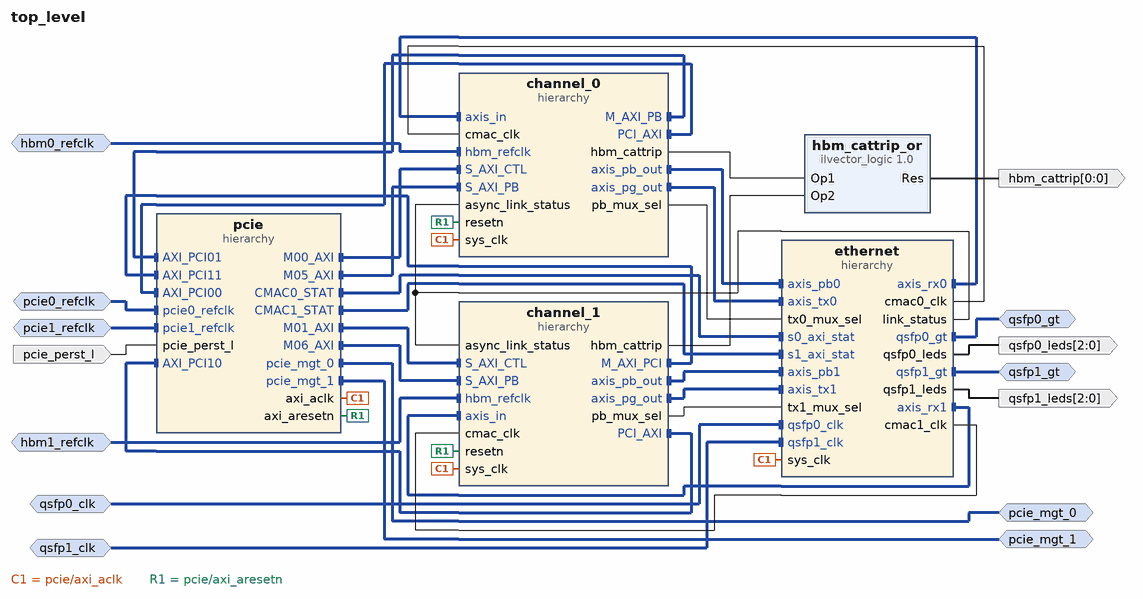
[diagram p0: block diagram of the top level]
# Vivado block design top_level, xcu55c-fsvh2892-2L-e, Vivado 2024.2
create_bd_design top_level

create_bd_intf_port -mode Slave -vlnv xilinx.com:interface:diff_clock_rtl:1.0 pcie0_refclk
create_bd_intf_port -mode Master -vlnv xilinx.com:interface:pcie_7x_mgt_rtl:1.0 pcie_mgt_0
create_bd_intf_port -mode Master -vlnv xilinx.com:interface:gt_rtl:1.0 qsfp0_gt
create_bd_intf_port -mode Slave -vlnv xilinx.com:interface:diff_clock_rtl:1.0 qsfp0_clk
set_property -dict {CONFIG.FREQ_HZ 161132812} [get_bd_intf_ports qsfp0_clk]
create_bd_intf_port -mode Slave -vlnv xilinx.com:interface:diff_clock_rtl:1.0 qsfp1_clk
set_property -dict {CONFIG.FREQ_HZ 161132812} [get_bd_intf_ports qsfp1_clk]
create_bd_intf_port -mode Master -vlnv xilinx.com:interface:gt_rtl:1.0 qsfp1_gt
create_bd_intf_port -mode Slave -vlnv xilinx.com:interface:diff_clock_rtl:1.0 hbm0_refclk
create_bd_intf_port -mode Slave -vlnv xilinx.com:interface:diff_clock_rtl:1.0 hbm1_refclk
create_bd_intf_port -mode Master -vlnv xilinx.com:interface:pcie_7x_mgt_rtl:1.0 pcie_mgt_1
create_bd_intf_port -mode Slave -vlnv xilinx.com:interface:diff_clock_rtl:1.0 pcie1_refclk
create_bd_port -dir O -from 0 -to 0 hbm_cattrip
create_bd_port -dir I -type rst pcie_perst_l
create_bd_port -dir O -from 2 -to 0 qsfp0_leds
create_bd_port -dir O -from 2 -to 0 qsfp1_leds

create_bd_cell -type hier pcie
create_bd_cell -type hier ethernet
create_bd_cell -type hier channel_0
create_bd_cell -type hier channel_1
create_bd_cell -type inline_hdl -vlnv xilinx.com:inline_hdl:ilvector_logic:1.0 hbm_cattrip_or
set_property -dict {CONFIG.C_OPERATION or CONFIG.C_SIZE 1} [get_bd_cells hbm_cattrip_or]

# ---- hierarchy /pcie ----
current_bd_instance /pcie
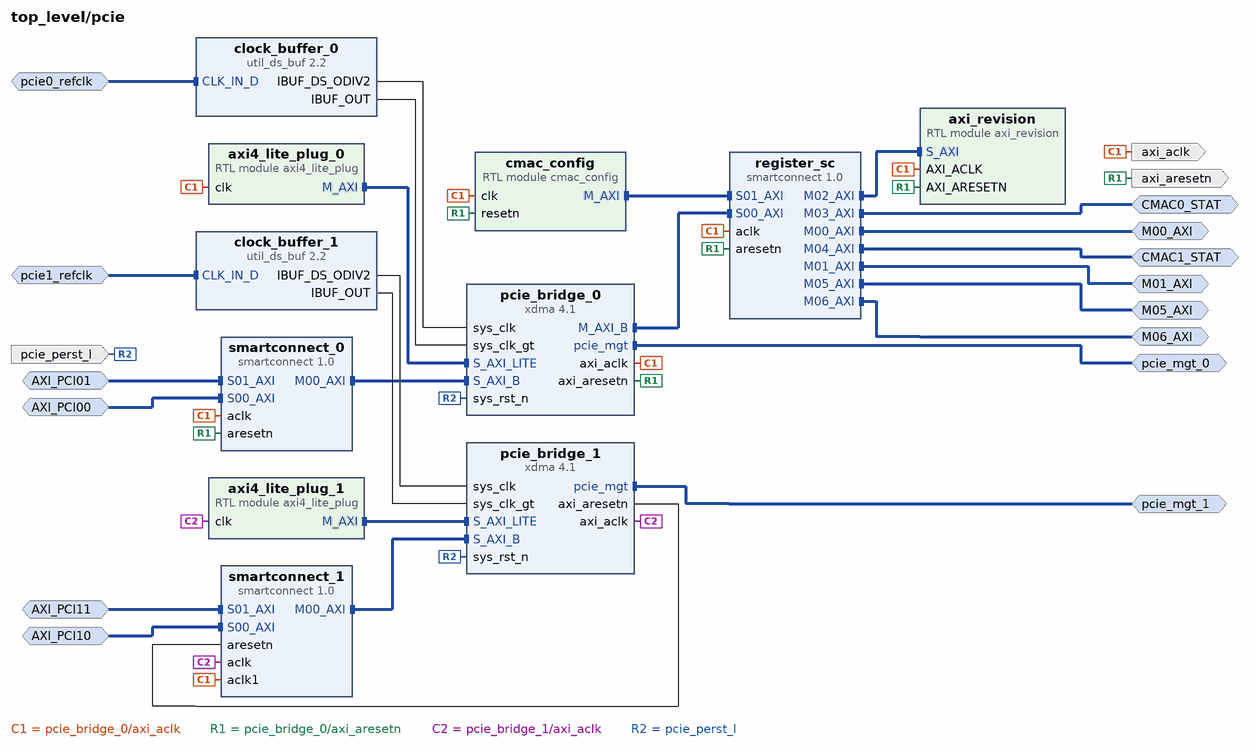
[diagram p1: block diagram inside /pcie]
create_bd_intf_pin -mode Master -vlnv xilinx.com:interface:pcie_7x_mgt_rtl:1.0 pcie_mgt_0
create_bd_intf_pin -mode Slave -vlnv xilinx.com:interface:diff_clock_rtl:1.0 pcie0_refclk
create_bd_intf_pin -mode Master -vlnv xilinx.com:interface:aximm_rtl:1.0 M00_AXI
create_bd_intf_pin -mode Master -vlnv xilinx.com:interface:aximm_rtl:1.0 M01_AXI
create_bd_intf_pin -mode Slave -vlnv xilinx.com:interface:aximm_rtl:1.0 AXI_PCI00
create_bd_intf_pin -mode Master -vlnv xilinx.com:interface:aximm_rtl:1.0 CMAC0_STAT
create_bd_intf_pin -mode Master -vlnv xilinx.com:interface:aximm_rtl:1.0 CMAC1_STAT
create_bd_intf_pin -mode Slave -vlnv xilinx.com:interface:diff_clock_rtl:1.0 pcie1_refclk
create_bd_intf_pin -mode Slave -vlnv xilinx.com:interface:aximm_rtl:1.0 AXI_PCI10
create_bd_intf_pin -mode Master -vlnv xilinx.com:interface:pcie_7x_mgt_rtl:1.0 pcie_mgt_1
create_bd_intf_pin -mode Master -vlnv xilinx.com:interface:aximm_rtl:1.0 M05_AXI
create_bd_intf_pin -mode Master -vlnv xilinx.com:interface:aximm_rtl:1.0 M06_AXI
create_bd_intf_pin -mode Slave -vlnv xilinx.com:interface:aximm_rtl:1.0 AXI_PCI01
create_bd_intf_pin -mode Slave -vlnv xilinx.com:interface:aximm_rtl:1.0 AXI_PCI11
create_bd_pin -dir I -type rst pcie_perst_l
create_bd_pin -dir O axi_aresetn
create_bd_pin -dir O axi_aclk

create_bd_cell -type ip -vlnv xilinx.com:ip:xdma:4.1 pcie_bridge_0
set_property -dict [list \
  CONFIG.PF0_DEVICE_ID_mqdma 9048 \
  CONFIG.PF0_SRIOV_VF_DEVICE_ID A048 \
  CONFIG.PF2_DEVICE_ID_mqdma 9248 \
  CONFIG.PF3_DEVICE_ID_mqdma 9348 \
  CONFIG.axi_addr_width 64 \
  CONFIG.axi_data_width 512_bit \
  CONFIG.axisten_freq 250 \
  CONFIG.bridge_burst true \
  CONFIG.en_axi_slave_if true \
  CONFIG.en_gt_selection false \
  CONFIG.functional_mode AXI_Bridge \
  CONFIG.mode_selection Advanced \
  CONFIG.pcie_blk_locn PCIE4C_X1Y1 \
  CONFIG.pf0_bar0_scale Megabytes \
  CONFIG.pf0_bar0_size 1 \
  CONFIG.pf0_device_id 903F \
  CONFIG.pf0_msi_enabled false \
  CONFIG.pl_link_cap_max_link_speed 16.0_GT/s \
  CONFIG.pl_link_cap_max_link_width X8 \
  CONFIG.runbit_fix false \
  CONFIG.xlnx_ref_board None \
] [get_bd_cells pcie_bridge_0]
create_bd_cell -type ip -vlnv xilinx.com:ip:util_ds_buf:2.2 clock_buffer_0
set_property -dict {CONFIG.C_BUF_TYPE IBUFDSGTE} [get_bd_cells clock_buffer_0]
create_bd_cell -type module -reference axi4_lite_plug axi4_lite_plug_0
create_bd_cell -type ip -vlnv xilinx.com:ip:smartconnect:1.0 register_sc
set_property -dict {CONFIG.NUM_MI 7 CONFIG.NUM_SI 2} [get_bd_cells register_sc]
create_bd_cell -type module -reference axi_revision axi_revision
create_bd_cell -type ip -vlnv xilinx.com:ip:smartconnect:1.0 smartconnect_0
create_bd_cell -type ip -vlnv xilinx.com:ip:xdma:4.1 pcie_bridge_1
set_property -dict [list \
  CONFIG.PF0_DEVICE_ID_mqdma 9048 \
  CONFIG.PF0_SRIOV_VF_DEVICE_ID A048 \
  CONFIG.PF2_DEVICE_ID_mqdma 9248 \
  CONFIG.PF3_DEVICE_ID_mqdma 9348 \
  CONFIG.axi_addr_width 64 \
  CONFIG.axi_data_width 512_bit \
  CONFIG.axisten_freq 250 \
  CONFIG.bridge_burst true \
  CONFIG.en_axi_master_if false \
  CONFIG.en_axi_slave_if true \
  CONFIG.en_gt_selection true \
  CONFIG.functional_mode AXI_Bridge \
  CONFIG.mode_selection Advanced \
  CONFIG.pcie_blk_locn PCIE4C_X1Y0 \
  CONFIG.pf0_bar0_scale Megabytes \
  CONFIG.pf0_bar0_size 1 \
  CONFIG.pf0_device_id 9040 \
  CONFIG.pf0_msi_enabled false \
  CONFIG.pl_link_cap_max_link_speed 16.0_GT/s \
  CONFIG.pl_link_cap_max_link_width X8 \
  CONFIG.runbit_fix false \
  CONFIG.select_quad GTY_Quad_225 \
  CONFIG.xlnx_ref_board None \
] [get_bd_cells pcie_bridge_1]
create_bd_cell -type ip -vlnv xilinx.com:ip:util_ds_buf:2.2 clock_buffer_1
set_property -dict {CONFIG.C_BUF_TYPE IBUFDSGTE} [get_bd_cells clock_buffer_1]
create_bd_cell -type module -reference axi4_lite_plug axi4_lite_plug_1
create_bd_cell -type ip -vlnv xilinx.com:ip:smartconnect:1.0 smartconnect_1
set_property -dict {CONFIG.NUM_CLKS 2} [get_bd_cells smartconnect_1]
create_bd_cell -type module -reference cmac_config cmac_config

# ---- hierarchy /ethernet ----
current_bd_instance /ethernet
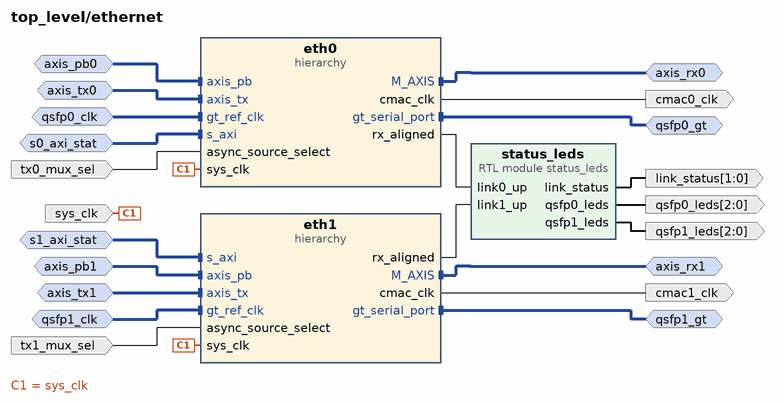
[diagram p2: block diagram inside /ethernet]
create_bd_intf_pin -mode Master -vlnv xilinx.com:interface:gt_rtl:1.0 qsfp0_gt
create_bd_intf_pin -mode Slave -vlnv xilinx.com:interface:diff_clock_rtl:1.0 qsfp0_clk
create_bd_intf_pin -mode Slave -vlnv xilinx.com:interface:axis_rtl:1.0 axis_tx0
create_bd_intf_pin -mode Master -vlnv xilinx.com:interface:axis_rtl:1.0 axis_rx0
create_bd_intf_pin -mode Master -vlnv xilinx.com:interface:gt_rtl:1.0 qsfp1_gt
create_bd_intf_pin -mode Slave -vlnv xilinx.com:interface:diff_clock_rtl:1.0 qsfp1_clk
create_bd_intf_pin -mode Master -vlnv xilinx.com:interface:axis_rtl:1.0 axis_rx1
create_bd_intf_pin -mode Slave -vlnv xilinx.com:interface:axis_rtl:1.0 axis_tx1
create_bd_intf_pin -mode Slave -vlnv xilinx.com:interface:aximm_rtl:1.0 s0_axi_stat
create_bd_intf_pin -mode Slave -vlnv xilinx.com:interface:aximm_rtl:1.0 s1_axi_stat
create_bd_intf_pin -mode Slave -vlnv xilinx.com:interface:axis_rtl:1.0 axis_pb0
create_bd_intf_pin -mode Slave -vlnv xilinx.com:interface:axis_rtl:1.0 axis_pb1
create_bd_pin -dir I sys_clk
create_bd_pin -dir O -from 2 -to 0 qsfp0_leds
create_bd_pin -dir O -from 2 -to 0 qsfp1_leds
create_bd_pin -dir O cmac0_clk
create_bd_pin -dir O cmac1_clk
create_bd_pin -dir O -from 1 -to 0 link_status
create_bd_pin -dir I tx0_mux_sel
create_bd_pin -dir I tx1_mux_sel

create_bd_cell -type hier eth0
create_bd_cell -type hier eth1
create_bd_cell -type module -reference status_leds status_leds

# ---- hierarchy /ethernet/eth0 ----
current_bd_instance /ethernet/eth0
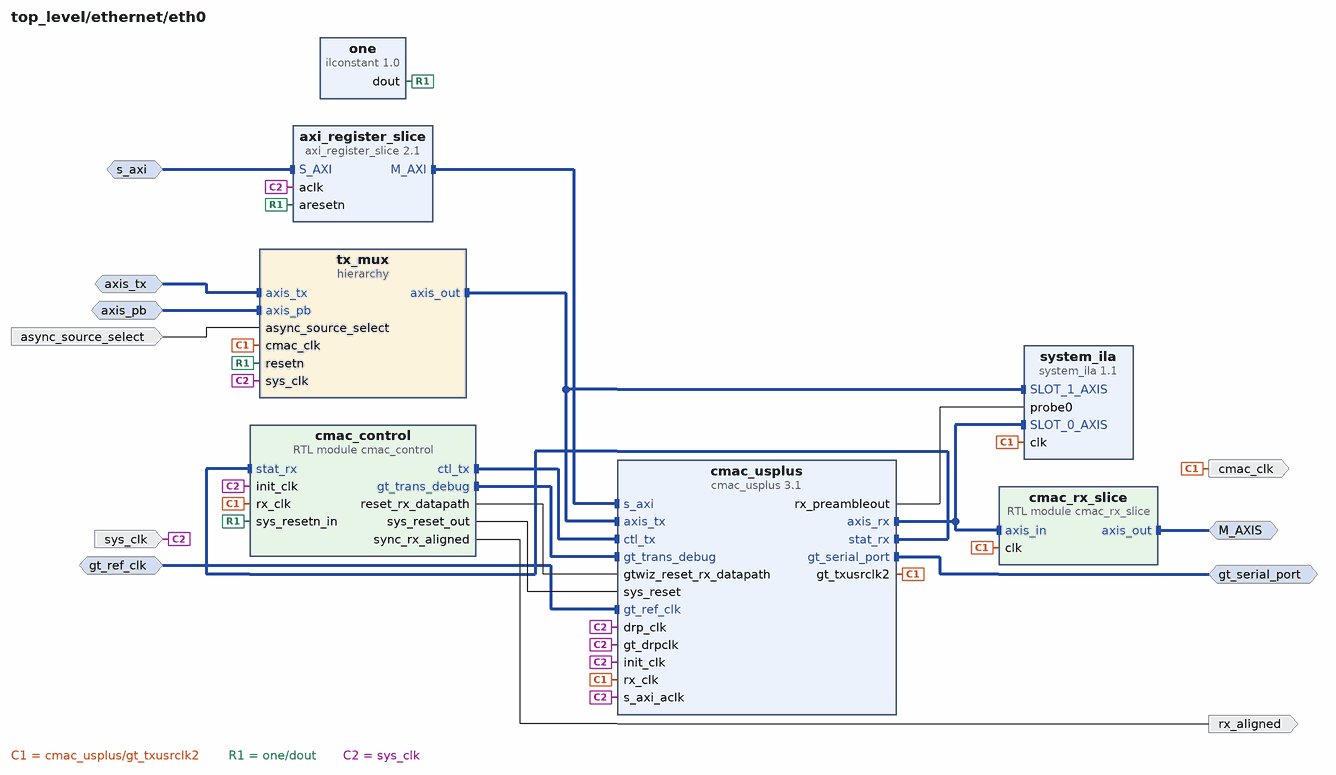
[diagram p3: block diagram inside /ethernet/eth0]
create_bd_intf_pin -mode Master -vlnv xilinx.com:interface:gt_rtl:1.0 gt_serial_port
create_bd_intf_pin -mode Slave -vlnv xilinx.com:interface:diff_clock_rtl:1.0 gt_ref_clk
create_bd_intf_pin -mode Master -vlnv xilinx.com:interface:axis_rtl:1.0 M_AXIS
create_bd_intf_pin -mode Slave -vlnv xilinx.com:interface:aximm_rtl:1.0 s_axi
create_bd_intf_pin -mode Slave -vlnv xilinx.com:interface:axis_rtl:1.0 axis_tx
create_bd_intf_pin -mode Slave -vlnv xilinx.com:interface:axis_rtl:1.0 axis_pb
create_bd_pin -dir I sys_clk
create_bd_pin -dir O rx_aligned
create_bd_pin -dir O cmac_clk
create_bd_pin -dir I async_source_select

create_bd_cell -type module -reference cmac_control cmac_control
set_property -dict {CONFIG.USE_SYS_RESET_OUT 0} [get_bd_cells cmac_control]
create_bd_cell -type ip -vlnv xilinx.com:ip:cmac_usplus:3.1 cmac_usplus
set_property -dict [list \
  CONFIG.ADD_GT_CNRL_STS_PORTS 1 \
  CONFIG.CMAC_CAUI4_MODE 1 \
  CONFIG.ENABLE_AXI_INTERFACE 1 \
  CONFIG.GT_DRP_CLK 250 \
  CONFIG.INCLUDE_RS_FEC 1 \
  CONFIG.INCLUDE_STATISTICS_COUNTERS 1 \
  CONFIG.RX_FLOW_CONTROL 0 \
  CONFIG.TX_FLOW_CONTROL 0 \
  CONFIG.USER_INTERFACE AXIS \
] [get_bd_cells cmac_usplus]
create_bd_cell -type ip -vlnv xilinx.com:ip:system_ila:1.1 system_ila
set_property -dict [list \
  CONFIG.C_DATA_DEPTH 2048 \
  CONFIG.C_MON_TYPE MIX \
  CONFIG.C_NUM_MONITOR_SLOTS 2 \
  CONFIG.C_SLOT 0 \
  CONFIG.C_SLOT_0_INTF_TYPE xilinx.com:interface:axis_rtl:1.0 \
  CONFIG.C_SLOT_1_INTF_TYPE xilinx.com:interface:axis_rtl:1.0 \
] [get_bd_cells system_ila]
create_bd_cell -type inline_hdl -vlnv xilinx.com:inline_hdl:ilconstant:1.0 one
create_bd_cell -type module -reference cmac_rx_slice cmac_rx_slice
create_bd_cell -type hier tx_mux
create_bd_cell -type ip -vlnv xilinx.com:ip:axi_register_slice:2.1 axi_register_slice

# ---- hierarchy /ethernet/eth0/tx_mux ----
current_bd_instance /ethernet/eth0/tx_mux
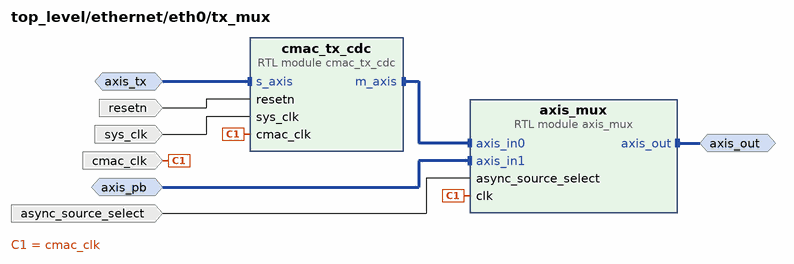
[diagram p4: block diagram inside /ethernet/eth0/tx_mux]
create_bd_intf_pin -mode Slave -vlnv xilinx.com:interface:axis_rtl:1.0 axis_tx
create_bd_intf_pin -mode Slave -vlnv xilinx.com:interface:axis_rtl:1.0 axis_pb
create_bd_intf_pin -mode Master -vlnv xilinx.com:interface:axis_rtl:1.0 axis_out
create_bd_pin -dir I sys_clk
create_bd_pin -dir I -type rst resetn
create_bd_pin -dir I -type clk cmac_clk
create_bd_pin -dir I async_source_select

create_bd_cell -type module -reference cmac_tx_cdc cmac_tx_cdc
set_property -dict {CONFIG.HAS_TKEEP 1} [get_bd_cells cmac_tx_cdc]
create_bd_cell -type module -reference axis_mux axis_mux

# ---- hierarchy /ethernet/eth1 ----
current_bd_instance /ethernet/eth1
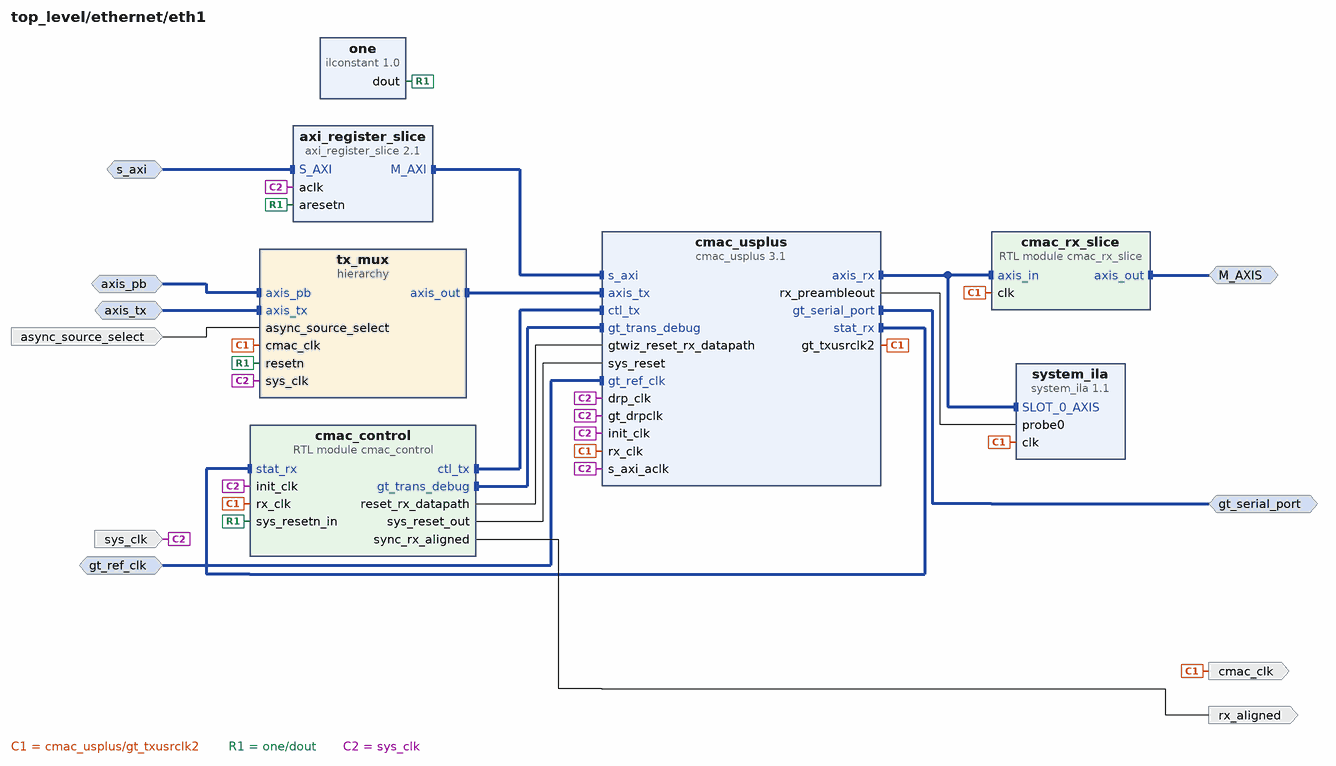
[diagram p5: block diagram inside /ethernet/eth1]
create_bd_intf_pin -mode Master -vlnv xilinx.com:interface:gt_rtl:1.0 gt_serial_port
create_bd_intf_pin -mode Slave -vlnv xilinx.com:interface:diff_clock_rtl:1.0 gt_ref_clk
create_bd_intf_pin -mode Master -vlnv xilinx.com:interface:axis_rtl:1.0 M_AXIS
create_bd_intf_pin -mode Slave -vlnv xilinx.com:interface:aximm_rtl:1.0 s_axi
create_bd_intf_pin -mode Slave -vlnv xilinx.com:interface:axis_rtl:1.0 axis_tx
create_bd_intf_pin -mode Slave -vlnv xilinx.com:interface:axis_rtl:1.0 axis_pb
create_bd_pin -dir I sys_clk
create_bd_pin -dir O rx_aligned
create_bd_pin -dir O cmac_clk
create_bd_pin -dir I async_source_select

create_bd_cell -type module -reference cmac_control cmac_control
set_property -dict {CONFIG.USE_SYS_RESET_OUT 0} [get_bd_cells cmac_control]
create_bd_cell -type ip -vlnv xilinx.com:ip:cmac_usplus:3.1 cmac_usplus
set_property -dict [list \
  CONFIG.ADD_GT_CNRL_STS_PORTS 1 \
  CONFIG.CMAC_CAUI4_MODE 1 \
  CONFIG.CMAC_CORE_SELECT CMACE4_X0Y4 \
  CONFIG.ENABLE_AXI_INTERFACE 1 \
  CONFIG.GT_DRP_CLK 250 \
  CONFIG.GT_GROUP_SELECT {X0Y28~X0Y31} \
  CONFIG.INCLUDE_RS_FEC 1 \
  CONFIG.INCLUDE_STATISTICS_COUNTERS 1 \
  CONFIG.RX_FLOW_CONTROL 0 \
  CONFIG.TX_FLOW_CONTROL 0 \
  CONFIG.USER_INTERFACE AXIS \
] [get_bd_cells cmac_usplus]
create_bd_cell -type ip -vlnv xilinx.com:ip:system_ila:1.1 system_ila
set_property -dict [list \
  CONFIG.C_DATA_DEPTH 2048 \
  CONFIG.C_MON_TYPE MIX \
  CONFIG.C_NUM_MONITOR_SLOTS 2 \
  CONFIG.C_SLOT 1 \
  CONFIG.C_SLOT_0_INTF_TYPE xilinx.com:interface:axis_rtl:1.0 \
  CONFIG.C_SLOT_1_INTF_TYPE xilinx.com:interface:axis_rtl:1.0 \
] [get_bd_cells system_ila]
create_bd_cell -type inline_hdl -vlnv xilinx.com:inline_hdl:ilconstant:1.0 one
create_bd_cell -type module -reference cmac_rx_slice cmac_rx_slice
create_bd_cell -type ip -vlnv xilinx.com:ip:axi_register_slice:2.1 axi_register_slice
create_bd_cell -type hier tx_mux

# ---- hierarchy /ethernet/eth1/tx_mux ----
current_bd_instance /ethernet/eth1/tx_mux
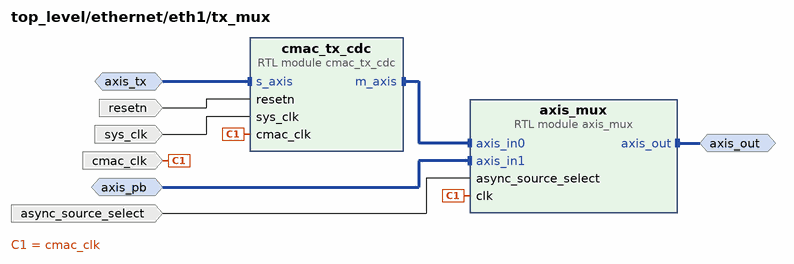
[diagram p6: block diagram inside /ethernet/eth1/tx_mux]
create_bd_intf_pin -mode Slave -vlnv xilinx.com:interface:axis_rtl:1.0 axis_tx
create_bd_intf_pin -mode Slave -vlnv xilinx.com:interface:axis_rtl:1.0 axis_pb
create_bd_intf_pin -mode Master -vlnv xilinx.com:interface:axis_rtl:1.0 axis_out
create_bd_pin -dir I sys_clk
create_bd_pin -dir I -type rst resetn
create_bd_pin -dir I -type clk cmac_clk
create_bd_pin -dir I async_source_select

create_bd_cell -type module -reference cmac_tx_cdc cmac_tx_cdc
set_property -dict {CONFIG.HAS_TKEEP 1} [get_bd_cells cmac_tx_cdc]
create_bd_cell -type module -reference axis_mux axis_mux

# ---- hierarchy /channel_0 ----
current_bd_instance /channel_0
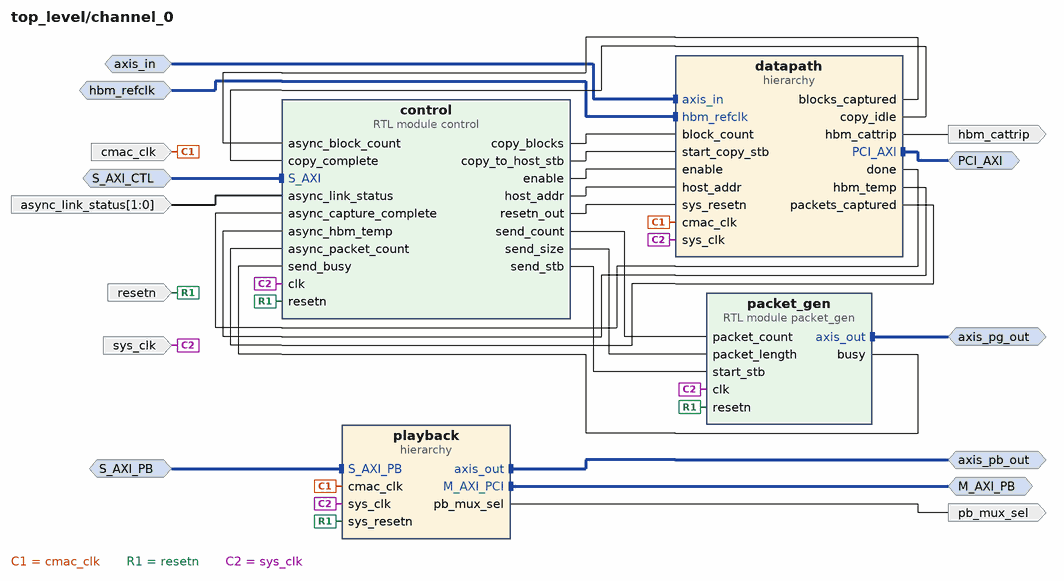
[diagram p7: block diagram inside /channel_0]
create_bd_intf_pin -mode Slave -vlnv xilinx.com:interface:aximm_rtl:1.0 S_AXI_CTL
create_bd_intf_pin -mode Master -vlnv xilinx.com:interface:axis_rtl:1.0 axis_pg_out
create_bd_intf_pin -mode Slave -vlnv xilinx.com:interface:axis_rtl:1.0 axis_in
create_bd_intf_pin -mode Slave -vlnv xilinx.com:interface:diff_clock_rtl:1.0 hbm_refclk
create_bd_intf_pin -mode Master -vlnv xilinx.com:interface:aximm_rtl:1.0 PCI_AXI
create_bd_intf_pin -mode Master -vlnv xilinx.com:interface:aximm_rtl:1.0 M_AXI_PB
create_bd_intf_pin -mode Master -vlnv xilinx.com:interface:axis_rtl:1.0 axis_pb_out
create_bd_intf_pin -mode Slave -vlnv xilinx.com:interface:aximm_rtl:1.0 S_AXI_PB
create_bd_pin -dir I -type rst resetn
create_bd_pin -dir I cmac_clk
create_bd_pin -dir I sys_clk
create_bd_pin -dir O hbm_cattrip
create_bd_pin -dir I -from 1 -to 0 async_link_status
create_bd_pin -dir O pb_mux_sel

create_bd_cell -type module -reference control control
create_bd_cell -type module -reference packet_gen packet_gen
create_bd_cell -type hier datapath
create_bd_cell -type hier playback

# ---- hierarchy /channel_0/datapath ----
current_bd_instance /channel_0/datapath
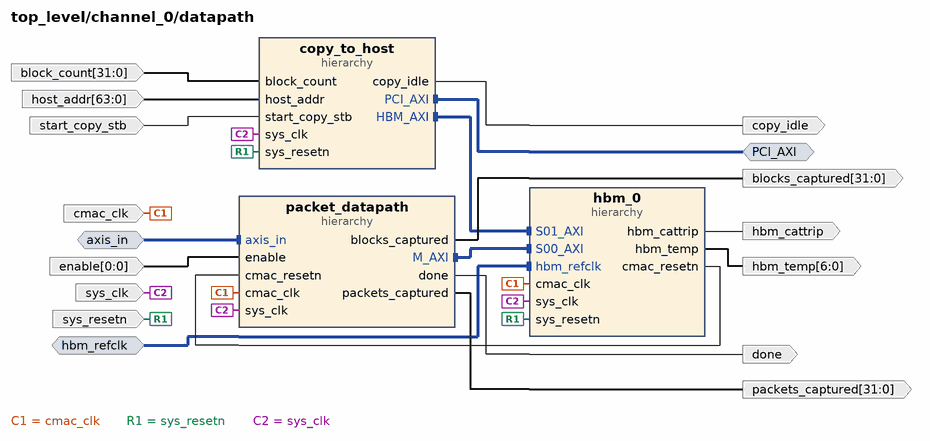
[diagram p8: block diagram inside /channel_0/datapath]
create_bd_intf_pin -mode Master -vlnv xilinx.com:interface:aximm_rtl:1.0 PCI_AXI
create_bd_intf_pin -mode Slave -vlnv xilinx.com:interface:diff_clock_rtl:1.0 hbm_refclk
create_bd_intf_pin -mode Slave -vlnv xilinx.com:interface:axis_rtl:1.0 axis_in
create_bd_pin -dir I -from 63 -to 0 host_addr
create_bd_pin -dir I -from 31 -to 0 block_count
create_bd_pin -dir I start_copy_stb
create_bd_pin -dir O copy_idle
create_bd_pin -dir I sys_clk
create_bd_pin -dir O hbm_cattrip
create_bd_pin -dir O -from 6 -to 0 hbm_temp
create_bd_pin -dir O done
create_bd_pin -dir O -from 31 -to 0 blocks_captured
create_bd_pin -dir O -from 31 -to 0 packets_captured
create_bd_pin -dir I sys_resetn
create_bd_pin -dir I -from 0 -to 0 enable
create_bd_pin -dir I cmac_clk

create_bd_cell -type hier hbm_0
create_bd_cell -type hier copy_to_host
create_bd_cell -type hier packet_datapath

# ---- hierarchy /channel_0/datapath/hbm_0 ----
current_bd_instance /channel_0/datapath/hbm_0
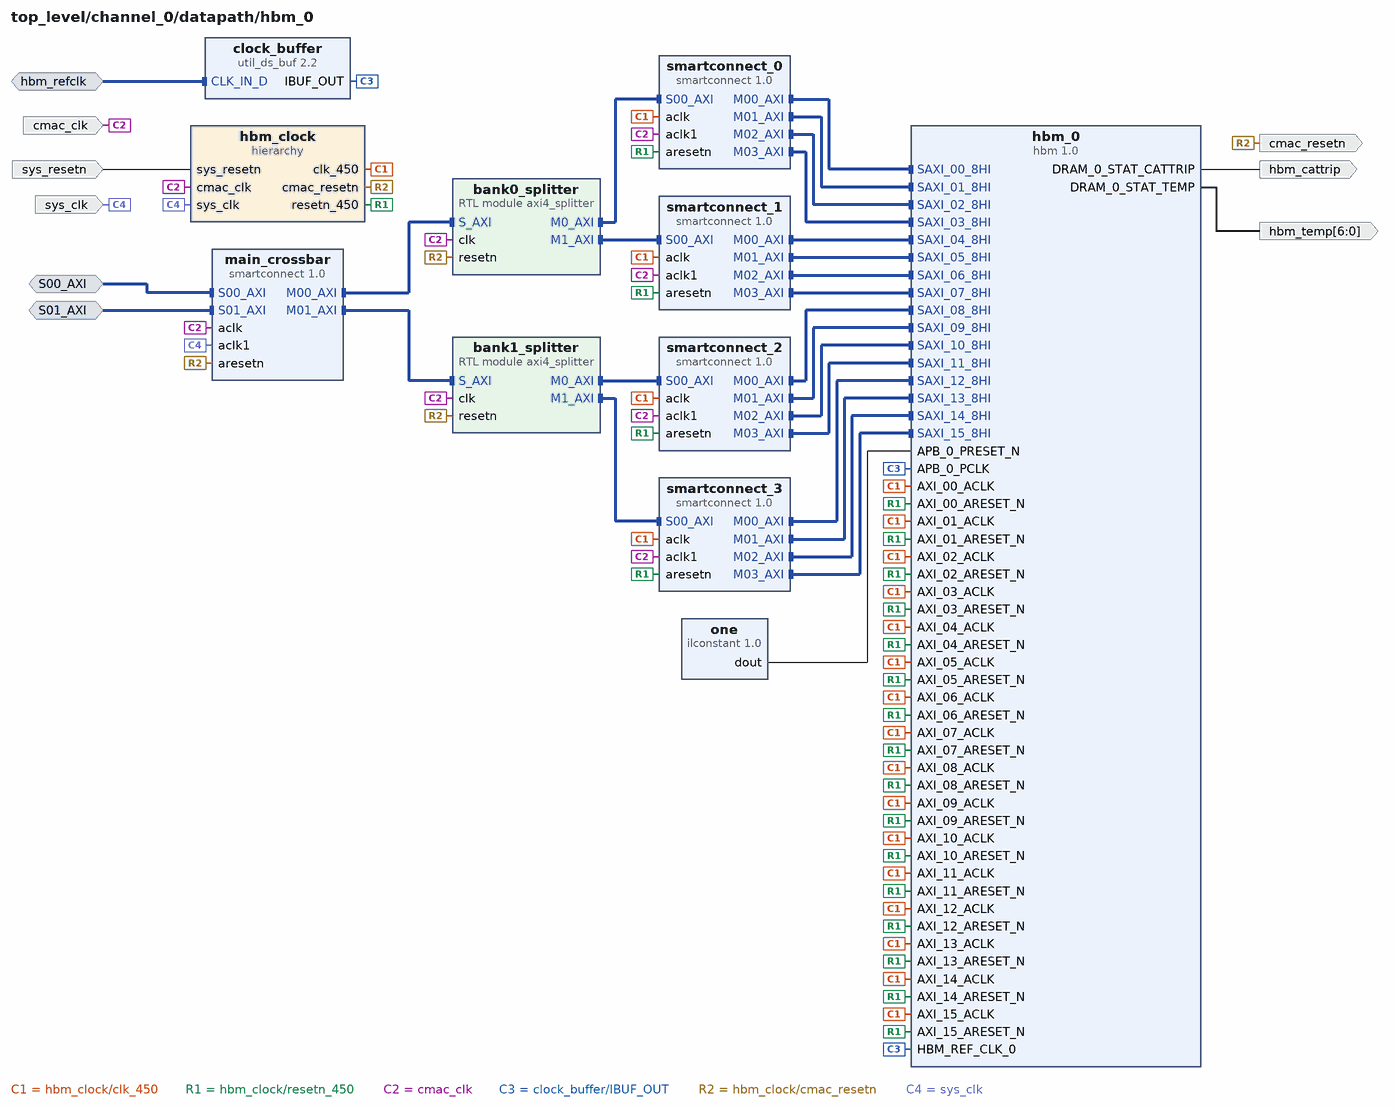
[diagram p9: block diagram inside /channel_0/datapath/hbm_0]
create_bd_intf_pin -mode Slave -vlnv xilinx.com:interface:diff_clock_rtl:1.0 hbm_refclk
create_bd_intf_pin -mode Slave -vlnv xilinx.com:interface:aximm_rtl:1.0 S00_AXI
create_bd_intf_pin -mode Slave -vlnv xilinx.com:interface:aximm_rtl:1.0 S01_AXI
create_bd_pin -dir O -from 6 -to 0 hbm_temp
create_bd_pin -dir O hbm_cattrip
create_bd_pin -dir I cmac_clk
create_bd_pin -dir I sys_clk
create_bd_pin -dir I sys_resetn
create_bd_pin -dir O cmac_resetn

create_bd_cell -type ip -vlnv xilinx.com:ip:hbm:1.0 hbm_0
set_property -dict [list \
  CONFIG.USER_APB_EN false \
  CONFIG.USER_MC0_ENABLE_ECC_CORRECTION true \
  CONFIG.USER_MC0_TRAFFIC_OPTION Linear \
  CONFIG.USER_SWITCH_ENABLE_00 FALSE \
] [get_bd_cells hbm_0]
create_bd_cell -type inline_hdl -vlnv xilinx.com:inline_hdl:ilconstant:1.0 one
create_bd_cell -type ip -vlnv xilinx.com:ip:util_ds_buf:2.2 clock_buffer
create_bd_cell -type module -reference axi4_splitter bank0_splitter
set_property -dict {CONFIG.BASE_ADDR1 0x0000000080000000} [get_bd_cells bank0_splitter]
create_bd_cell -type module -reference axi4_splitter bank1_splitter
set_property -dict [list \
  CONFIG.ADDR_OFFSET 0x0000000100000000 \
  CONFIG.BASE_ADDR0 0x0000000100000000 \
  CONFIG.BASE_ADDR1 0x0000000180000000 \
] [get_bd_cells bank1_splitter]
create_bd_cell -type ip -vlnv xilinx.com:ip:smartconnect:1.0 smartconnect_0
set_property -dict [list \
  CONFIG.ADVANCED_PROPERTIES {     __view__ { functional { M00_Buffer { AW_SIZE 4 } } }    } \
  CONFIG.NUM_CLKS 2 \
  CONFIG.NUM_MI 4 \
  CONFIG.NUM_SI 1 \
] [get_bd_cells smartconnect_0]
create_bd_cell -type ip -vlnv xilinx.com:ip:smartconnect:1.0 smartconnect_1
set_property -dict {CONFIG.NUM_CLKS 2 CONFIG.NUM_MI 4 CONFIG.NUM_SI 1} [get_bd_cells smartconnect_1]
create_bd_cell -type ip -vlnv xilinx.com:ip:smartconnect:1.0 smartconnect_2
set_property -dict {CONFIG.NUM_CLKS 2 CONFIG.NUM_MI 4 CONFIG.NUM_SI 1} [get_bd_cells smartconnect_2]
create_bd_cell -type ip -vlnv xilinx.com:ip:smartconnect:1.0 smartconnect_3
set_property -dict {CONFIG.NUM_CLKS 2 CONFIG.NUM_MI 4 CONFIG.NUM_SI 1} [get_bd_cells smartconnect_3]
create_bd_cell -type ip -vlnv xilinx.com:ip:smartconnect:1.0 main_crossbar
set_property -dict {CONFIG.NUM_CLKS 2 CONFIG.NUM_MI 2} [get_bd_cells main_crossbar]
create_bd_cell -type hier hbm_clock

# ---- hierarchy /channel_0/datapath/hbm_0/hbm_clock ----
current_bd_instance /channel_0/datapath/hbm_0/hbm_clock
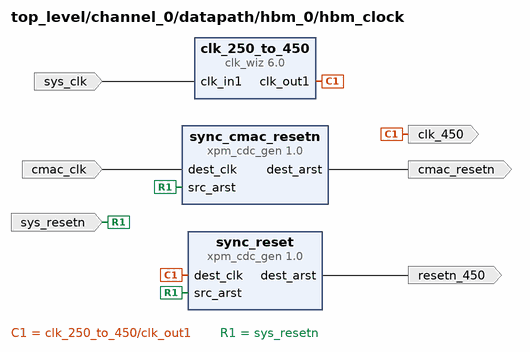
[diagram p10: block diagram inside /channel_0/datapath/hbm_0/hbm_clock]
create_bd_pin -dir I sys_clk
create_bd_pin -dir O clk_450
create_bd_pin -dir I sys_resetn
create_bd_pin -dir O resetn_450
create_bd_pin -dir I -type clk cmac_clk
create_bd_pin -dir O cmac_resetn

create_bd_cell -type ip -vlnv xilinx.com:ip:clk_wiz:6.0 clk_250_to_450
set_property -dict [list \
  CONFIG.CLKOUT1_JITTER 104.289 \
  CONFIG.CLKOUT1_PHASE_ERROR 153.873 \
  CONFIG.CLKOUT1_REQUESTED_OUT_FREQ 450.00 \
  CONFIG.MMCM_CLKFBOUT_MULT_F 23.625 \
  CONFIG.MMCM_CLKOUT0_DIVIDE_F 2.625 \
  CONFIG.MMCM_DIVCLK_DIVIDE 5 \
  CONFIG.USE_LOCKED false \
  CONFIG.USE_RESET false \
] [get_bd_cells clk_250_to_450]
create_bd_cell -type ip -vlnv xilinx.com:ip:xpm_cdc_gen:1.0 sync_reset
set_property -dict {CONFIG.CDC_TYPE xpm_cdc_async_rst} [get_bd_cells sync_reset]
create_bd_cell -type ip -vlnv xilinx.com:ip:xpm_cdc_gen:1.0 sync_cmac_resetn
set_property -dict {CONFIG.CDC_TYPE xpm_cdc_async_rst} [get_bd_cells sync_cmac_resetn]

# ---- hierarchy /channel_0/datapath/copy_to_host ----
current_bd_instance /channel_0/datapath/copy_to_host
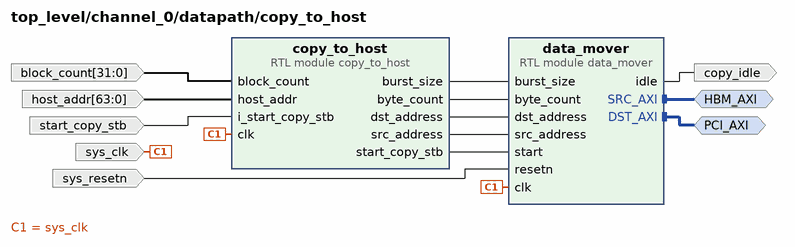
[diagram p11: block diagram inside /channel_0/datapath/copy_to_host]
create_bd_intf_pin -mode Master -vlnv xilinx.com:interface:aximm_rtl:1.0 PCI_AXI
create_bd_intf_pin -mode Master -vlnv xilinx.com:interface:aximm_rtl:1.0 HBM_AXI
create_bd_pin -dir I sys_clk
create_bd_pin -dir I sys_resetn
create_bd_pin -dir I start_copy_stb
create_bd_pin -dir O copy_idle
create_bd_pin -dir I -from 63 -to 0 host_addr
create_bd_pin -dir I -from 31 -to 0 block_count

create_bd_cell -type module -reference data_mover data_mover
create_bd_cell -type module -reference copy_to_host copy_to_host

# ---- hierarchy /channel_0/datapath/packet_datapath ----
current_bd_instance /channel_0/datapath/packet_datapath
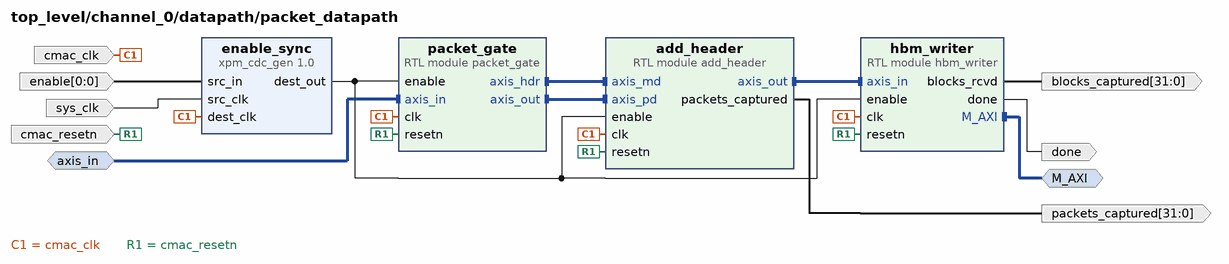
[diagram p12: block diagram inside /channel_0/datapath/packet_datapath]
create_bd_intf_pin -mode Slave -vlnv xilinx.com:interface:axis_rtl:1.0 axis_in
create_bd_intf_pin -mode Master -vlnv xilinx.com:interface:aximm_rtl:1.0 M_AXI
create_bd_pin -dir I sys_clk
create_bd_pin -dir I cmac_clk
create_bd_pin -dir I -from 0 -to 0 enable
create_bd_pin -dir I -type rst cmac_resetn
create_bd_pin -dir O -from 31 -to 0 packets_captured
create_bd_pin -dir O done
create_bd_pin -dir O -from 31 -to 0 blocks_captured

create_bd_cell -type ip -vlnv xilinx.com:ip:xpm_cdc_gen:1.0 enable_sync
set_property -dict [list \
  CONFIG.CDC_TYPE xpm_cdc_single \
  CONFIG.SIM_ASSERT_CHK false \
  CONFIG.SRC_INPUT_REG false \
] [get_bd_cells enable_sync]
create_bd_cell -type module -reference add_header add_header
create_bd_cell -type module -reference packet_gate packet_gate
create_bd_cell -type module -reference hbm_writer hbm_writer

# ---- hierarchy /channel_0/playback ----
current_bd_instance /channel_0/playback
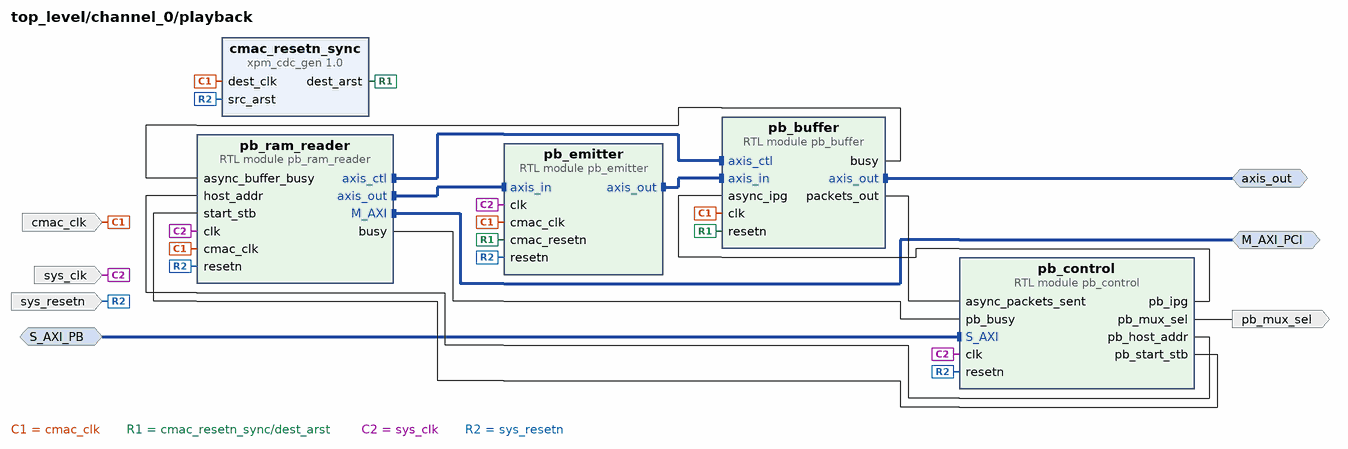
[diagram p13: block diagram inside /channel_0/playback]
create_bd_intf_pin -mode Slave -vlnv xilinx.com:interface:aximm_rtl:1.0 S_AXI_PB
create_bd_intf_pin -mode Master -vlnv xilinx.com:interface:aximm_rtl:1.0 M_AXI_PCI
create_bd_intf_pin -mode Master -vlnv xilinx.com:interface:axis_rtl:1.0 axis_out
create_bd_pin -dir I sys_clk
create_bd_pin -dir I sys_resetn
create_bd_pin -dir I cmac_clk
create_bd_pin -dir O pb_mux_sel

create_bd_cell -type module -reference pb_control pb_control
create_bd_cell -type module -reference pb_ram_reader pb_ram_reader
create_bd_cell -type module -reference pb_emitter pb_emitter
create_bd_cell -type module -reference pb_buffer pb_buffer
create_bd_cell -type ip -vlnv xilinx.com:ip:xpm_cdc_gen:1.0 cmac_resetn_sync
set_property -dict {CONFIG.CDC_TYPE xpm_cdc_async_rst} [get_bd_cells cmac_resetn_sync]

# ---- hierarchy /channel_1 ----
current_bd_instance /channel_1
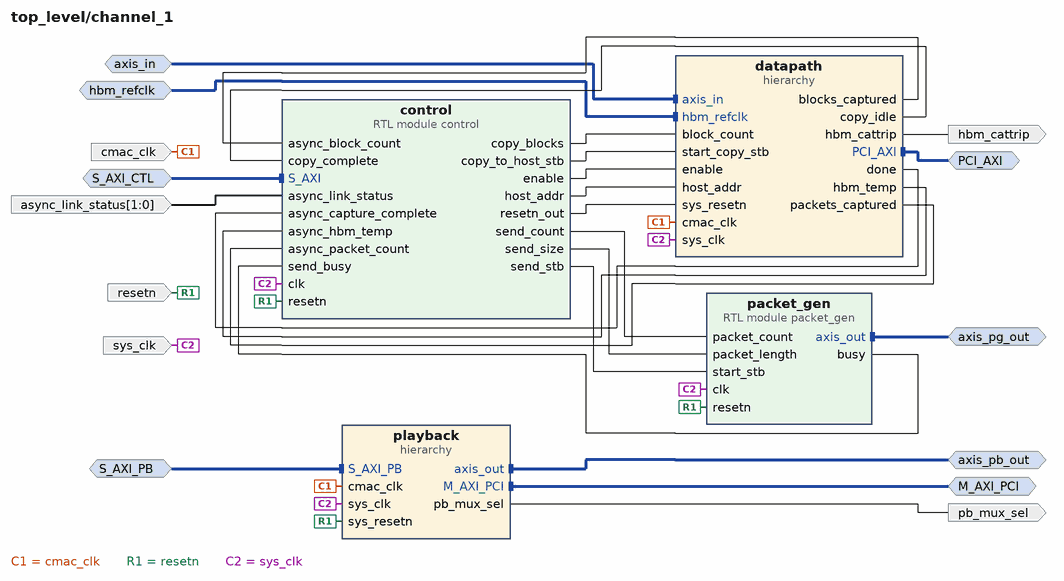
[diagram p14: block diagram inside /channel_1]
create_bd_intf_pin -mode Slave -vlnv xilinx.com:interface:aximm_rtl:1.0 S_AXI_CTL
create_bd_intf_pin -mode Master -vlnv xilinx.com:interface:axis_rtl:1.0 axis_pg_out
create_bd_intf_pin -mode Slave -vlnv xilinx.com:interface:axis_rtl:1.0 axis_in
create_bd_intf_pin -mode Slave -vlnv xilinx.com:interface:diff_clock_rtl:1.0 hbm_refclk
create_bd_intf_pin -mode Master -vlnv xilinx.com:interface:aximm_rtl:1.0 PCI_AXI
create_bd_intf_pin -mode Slave -vlnv xilinx.com:interface:aximm_rtl:1.0 S_AXI_PB
create_bd_intf_pin -mode Master -vlnv xilinx.com:interface:aximm_rtl:1.0 M_AXI_PCI
create_bd_intf_pin -mode Master -vlnv xilinx.com:interface:axis_rtl:1.0 axis_pb_out
create_bd_pin -dir I -type rst resetn
create_bd_pin -dir I cmac_clk
create_bd_pin -dir I sys_clk
create_bd_pin -dir O hbm_cattrip
create_bd_pin -dir I -from 1 -to 0 async_link_status
create_bd_pin -dir O pb_mux_sel

create_bd_cell -type module -reference control control
create_bd_cell -type module -reference packet_gen packet_gen
create_bd_cell -type hier datapath
create_bd_cell -type hier playback

# ---- hierarchy /channel_1/datapath ----
current_bd_instance /channel_1/datapath
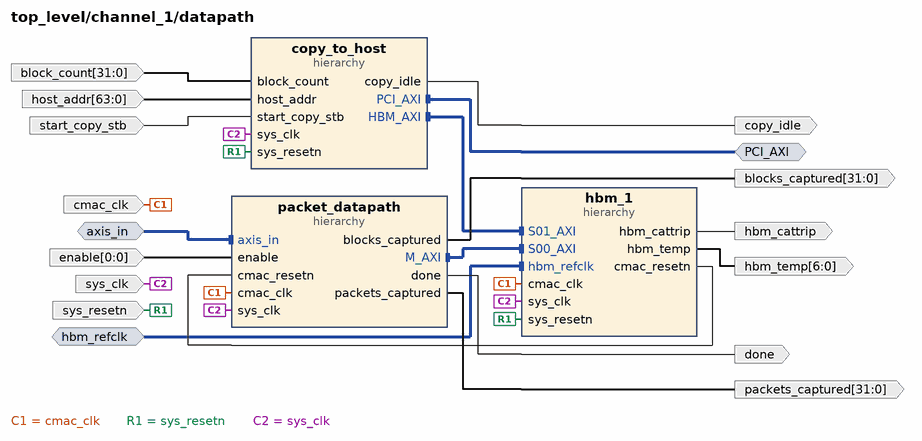
[diagram p15: block diagram inside /channel_1/datapath]
create_bd_intf_pin -mode Slave -vlnv xilinx.com:interface:axis_rtl:1.0 axis_in
create_bd_intf_pin -mode Slave -vlnv xilinx.com:interface:diff_clock_rtl:1.0 hbm_refclk
create_bd_intf_pin -mode Master -vlnv xilinx.com:interface:aximm_rtl:1.0 PCI_AXI
create_bd_pin -dir I cmac_clk
create_bd_pin -dir I sys_resetn
create_bd_pin -dir I -from 0 -to 0 enable
create_bd_pin -dir O -from 31 -to 0 packets_captured
create_bd_pin -dir O -from 31 -to 0 blocks_captured
create_bd_pin -dir O done
create_bd_pin -dir O -from 6 -to 0 hbm_temp
create_bd_pin -dir O hbm_cattrip
create_bd_pin -dir I sys_clk
create_bd_pin -dir I start_copy_stb
create_bd_pin -dir I -from 63 -to 0 host_addr
create_bd_pin -dir I -from 31 -to 0 block_count
create_bd_pin -dir O copy_idle

create_bd_cell -type hier hbm_1
create_bd_cell -type hier copy_to_host
create_bd_cell -type hier packet_datapath

# ---- hierarchy /channel_1/datapath/hbm_1 ----
current_bd_instance /channel_1/datapath/hbm_1
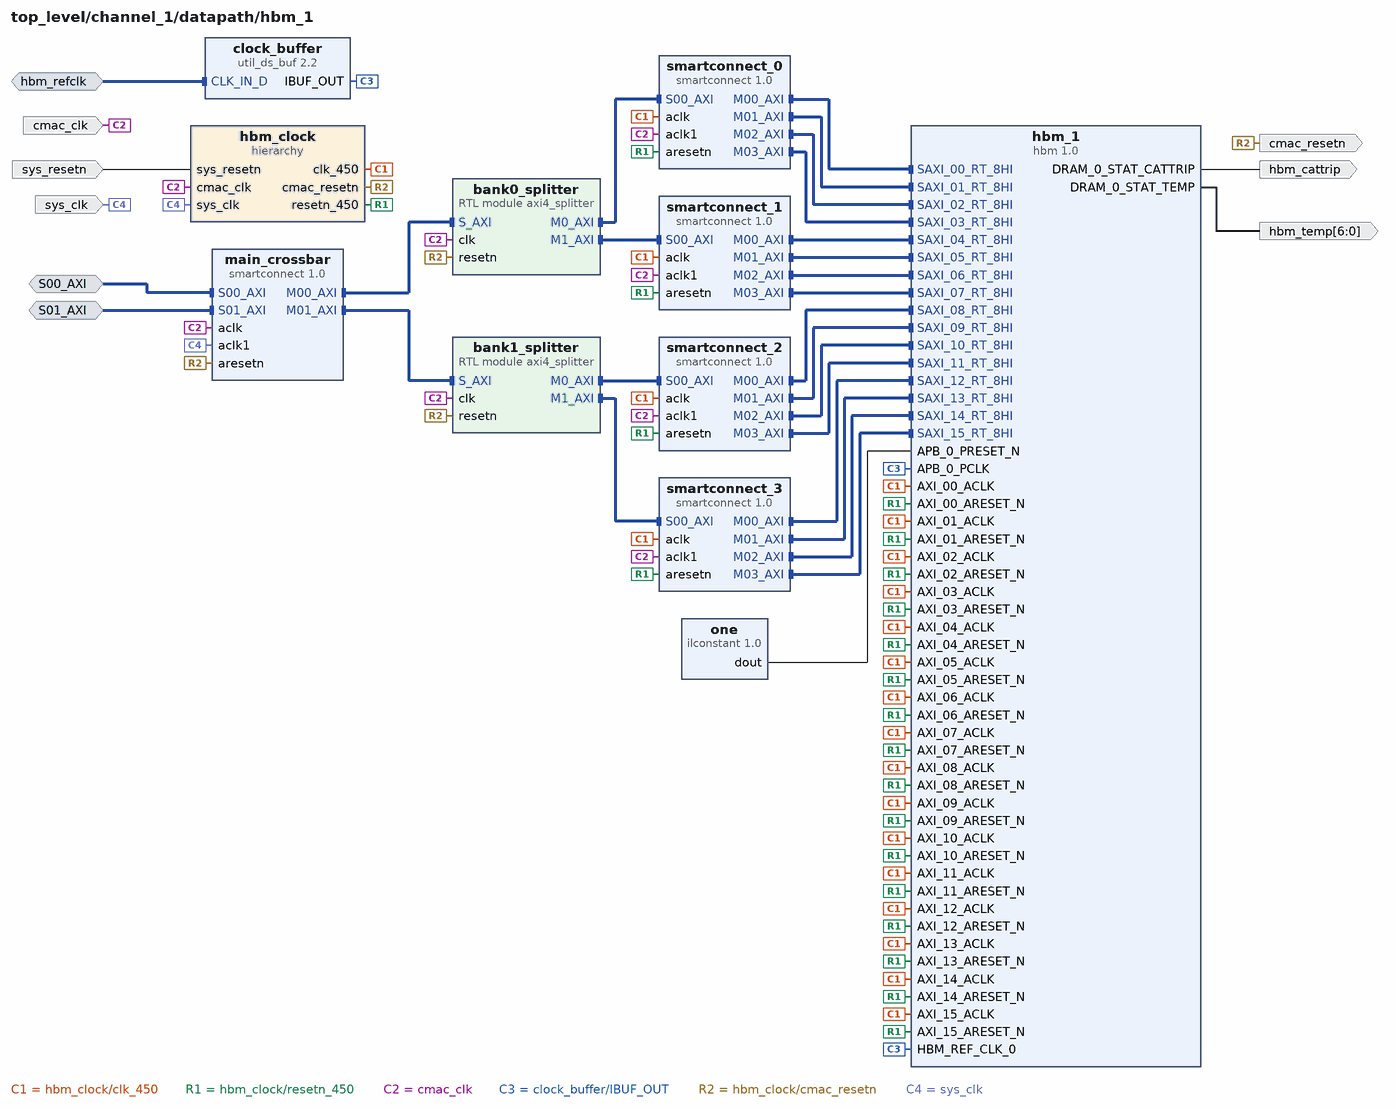
[diagram p16: block diagram inside /channel_1/datapath/hbm_1]
create_bd_intf_pin -mode Slave -vlnv xilinx.com:interface:diff_clock_rtl:1.0 hbm_refclk
create_bd_intf_pin -mode Slave -vlnv xilinx.com:interface:aximm_rtl:1.0 S00_AXI
create_bd_intf_pin -mode Slave -vlnv xilinx.com:interface:aximm_rtl:1.0 S01_AXI
create_bd_pin -dir O -from 6 -to 0 hbm_temp
create_bd_pin -dir O hbm_cattrip
create_bd_pin -dir I cmac_clk
create_bd_pin -dir I sys_clk
create_bd_pin -dir I sys_resetn
create_bd_pin -dir O cmac_resetn

create_bd_cell -type ip -vlnv xilinx.com:ip:hbm:1.0 hbm_1
set_property -dict [list \
  CONFIG.USER_APB_EN false \
  CONFIG.USER_MC0_ENABLE_ECC_CORRECTION true \
  CONFIG.USER_MC0_TRAFFIC_OPTION Linear \
  CONFIG.USER_SINGLE_STACK_SELECTION RIGHT \
  CONFIG.USER_SWITCH_ENABLE_00 FALSE \
] [get_bd_cells hbm_1]
create_bd_cell -type inline_hdl -vlnv xilinx.com:inline_hdl:ilconstant:1.0 one
create_bd_cell -type ip -vlnv xilinx.com:ip:util_ds_buf:2.2 clock_buffer
create_bd_cell -type module -reference axi4_splitter bank0_splitter
set_property -dict {CONFIG.BASE_ADDR0 0x0000000200000000 CONFIG.BASE_ADDR1 0x0000000280000000} [get_bd_cells bank0_splitter]
create_bd_cell -type module -reference axi4_splitter bank1_splitter
set_property -dict [list \
  CONFIG.ADDR_OFFSET 0x0000000100000000 \
  CONFIG.BASE_ADDR0 0x0000000300000000 \
  CONFIG.BASE_ADDR1 0x0000000380000000 \
] [get_bd_cells bank1_splitter]
create_bd_cell -type ip -vlnv xilinx.com:ip:smartconnect:1.0 smartconnect_0
set_property -dict [list \
  CONFIG.ADVANCED_PROPERTIES {     __view__ { functional { M00_Buffer { AW_SIZE 4 } } }    } \
  CONFIG.NUM_CLKS 2 \
  CONFIG.NUM_MI 4 \
  CONFIG.NUM_SI 1 \
] [get_bd_cells smartconnect_0]
create_bd_cell -type ip -vlnv xilinx.com:ip:smartconnect:1.0 smartconnect_1
set_property -dict {CONFIG.NUM_CLKS 2 CONFIG.NUM_MI 4 CONFIG.NUM_SI 1} [get_bd_cells smartconnect_1]
create_bd_cell -type ip -vlnv xilinx.com:ip:smartconnect:1.0 smartconnect_2
set_property -dict {CONFIG.NUM_CLKS 2 CONFIG.NUM_MI 4 CONFIG.NUM_SI 1} [get_bd_cells smartconnect_2]
create_bd_cell -type ip -vlnv xilinx.com:ip:smartconnect:1.0 smartconnect_3
set_property -dict {CONFIG.NUM_CLKS 2 CONFIG.NUM_MI 4 CONFIG.NUM_SI 1} [get_bd_cells smartconnect_3]
create_bd_cell -type ip -vlnv xilinx.com:ip:smartconnect:1.0 main_crossbar
set_property -dict {CONFIG.NUM_CLKS 2 CONFIG.NUM_MI 2} [get_bd_cells main_crossbar]
create_bd_cell -type hier hbm_clock

# ---- hierarchy /channel_1/datapath/hbm_1/hbm_clock ----
current_bd_instance /channel_1/datapath/hbm_1/hbm_clock
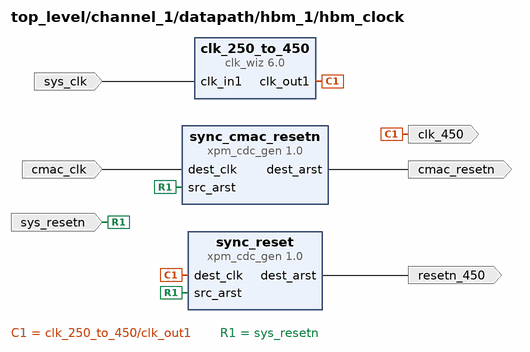
[diagram p17: block diagram inside /channel_1/datapath/hbm_1/hbm_clock]
create_bd_pin -dir I sys_clk
create_bd_pin -dir O clk_450
create_bd_pin -dir I sys_resetn
create_bd_pin -dir O resetn_450
create_bd_pin -dir I -type clk cmac_clk
create_bd_pin -dir O cmac_resetn

create_bd_cell -type ip -vlnv xilinx.com:ip:clk_wiz:6.0 clk_250_to_450
set_property -dict [list \
  CONFIG.CLKOUT1_JITTER 104.289 \
  CONFIG.CLKOUT1_PHASE_ERROR 153.873 \
  CONFIG.CLKOUT1_REQUESTED_OUT_FREQ 450.00 \
  CONFIG.MMCM_CLKFBOUT_MULT_F 23.625 \
  CONFIG.MMCM_CLKOUT0_DIVIDE_F 2.625 \
  CONFIG.MMCM_DIVCLK_DIVIDE 5 \
  CONFIG.USE_LOCKED false \
  CONFIG.USE_RESET false \
] [get_bd_cells clk_250_to_450]
create_bd_cell -type ip -vlnv xilinx.com:ip:xpm_cdc_gen:1.0 sync_reset
set_property -dict {CONFIG.CDC_TYPE xpm_cdc_async_rst} [get_bd_cells sync_reset]
create_bd_cell -type ip -vlnv xilinx.com:ip:xpm_cdc_gen:1.0 sync_cmac_resetn
set_property -dict {CONFIG.CDC_TYPE xpm_cdc_async_rst} [get_bd_cells sync_cmac_resetn]

# ---- hierarchy /channel_1/datapath/copy_to_host ----
current_bd_instance /channel_1/datapath/copy_to_host
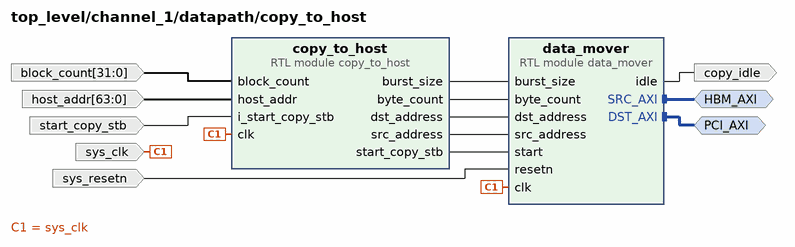
[diagram p18: block diagram inside /channel_1/datapath/copy_to_host]
create_bd_intf_pin -mode Master -vlnv xilinx.com:interface:aximm_rtl:1.0 PCI_AXI
create_bd_intf_pin -mode Master -vlnv xilinx.com:interface:aximm_rtl:1.0 HBM_AXI
create_bd_pin -dir I sys_clk
create_bd_pin -dir I sys_resetn
create_bd_pin -dir I start_copy_stb
create_bd_pin -dir O copy_idle
create_bd_pin -dir I -from 63 -to 0 host_addr
create_bd_pin -dir I -from 31 -to 0 block_count

create_bd_cell -type module -reference data_mover data_mover
create_bd_cell -type module -reference copy_to_host copy_to_host

# ---- hierarchy /channel_1/datapath/packet_datapath ----
current_bd_instance /channel_1/datapath/packet_datapath
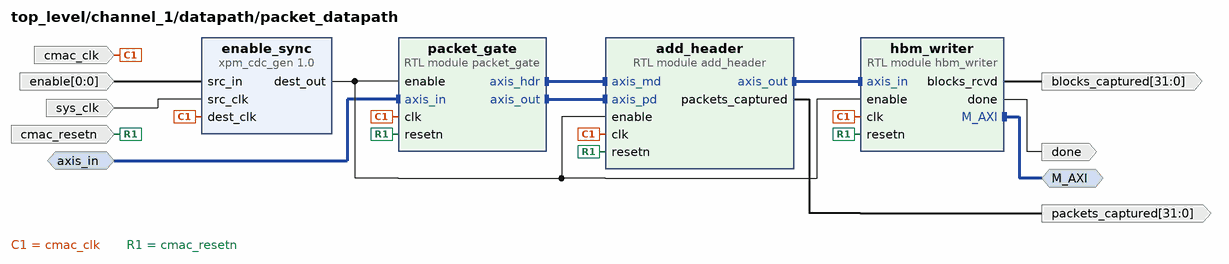
[diagram p19: block diagram inside /channel_1/datapath/packet_datapath]
create_bd_intf_pin -mode Slave -vlnv xilinx.com:interface:axis_rtl:1.0 axis_in
create_bd_intf_pin -mode Master -vlnv xilinx.com:interface:aximm_rtl:1.0 M_AXI
create_bd_pin -dir I sys_clk
create_bd_pin -dir I cmac_clk
create_bd_pin -dir I -from 0 -to 0 enable
create_bd_pin -dir I -type rst cmac_resetn
create_bd_pin -dir O -from 31 -to 0 packets_captured
create_bd_pin -dir O done
create_bd_pin -dir O -from 31 -to 0 blocks_captured

create_bd_cell -type ip -vlnv xilinx.com:ip:xpm_cdc_gen:1.0 enable_sync
set_property -dict [list \
  CONFIG.CDC_TYPE xpm_cdc_single \
  CONFIG.SIM_ASSERT_CHK false \
  CONFIG.SRC_INPUT_REG false \
] [get_bd_cells enable_sync]
create_bd_cell -type module -reference add_header add_header
create_bd_cell -type module -reference packet_gate packet_gate
create_bd_cell -type module -reference hbm_writer hbm_writer

# ---- hierarchy /channel_1/playback ----
current_bd_instance /channel_1/playback
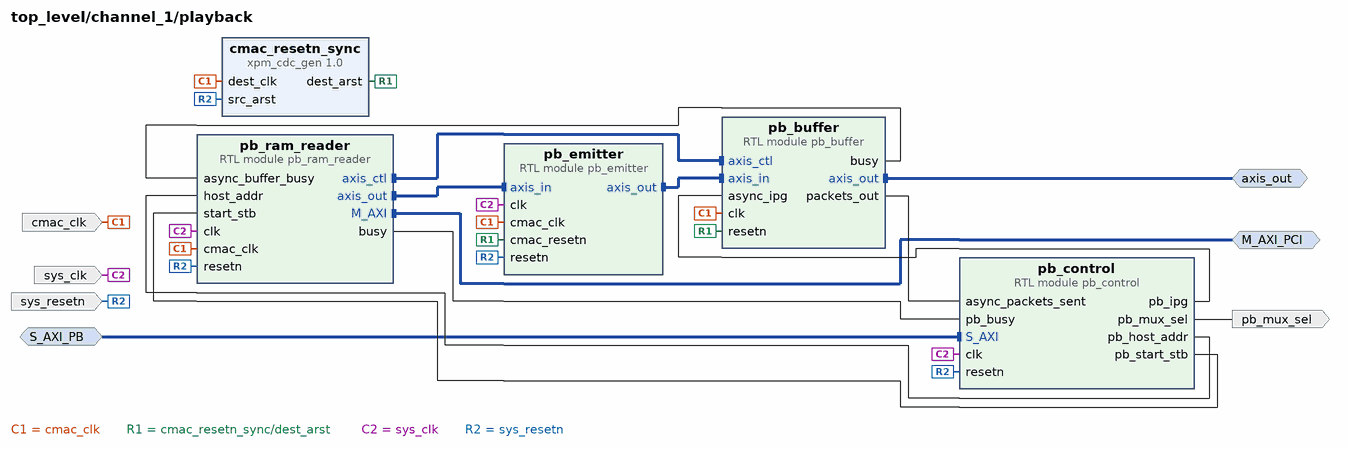
[diagram p20: block diagram inside /channel_1/playback]
create_bd_intf_pin -mode Slave -vlnv xilinx.com:interface:aximm_rtl:1.0 S_AXI_PB
create_bd_intf_pin -mode Master -vlnv xilinx.com:interface:aximm_rtl:1.0 M_AXI_PCI
create_bd_intf_pin -mode Master -vlnv xilinx.com:interface:axis_rtl:1.0 axis_out
create_bd_pin -dir I sys_clk
create_bd_pin -dir I sys_resetn
create_bd_pin -dir I cmac_clk
create_bd_pin -dir O pb_mux_sel

create_bd_cell -type module -reference pb_control pb_control
create_bd_cell -type module -reference pb_ram_reader pb_ram_reader
create_bd_cell -type module -reference pb_emitter pb_emitter
create_bd_cell -type module -reference pb_buffer pb_buffer
create_bd_cell -type ip -vlnv xilinx.com:ip:xpm_cdc_gen:1.0 cmac_resetn_sync
set_property -dict {CONFIG.CDC_TYPE xpm_cdc_async_rst} [get_bd_cells cmac_resetn_sync]

# ---- connections ----

current_bd_instance /pcie
connect_bd_intf_net [get_bd_intf_pins AXI_PCI01] [get_bd_intf_pins smartconnect_0/S01_AXI]
connect_bd_intf_net [get_bd_intf_pins AXI_PCI11] [get_bd_intf_pins smartconnect_1/S01_AXI]
connect_bd_intf_net [get_bd_intf_pins register_sc/M00_AXI] [get_bd_intf_pins M00_AXI]
connect_bd_intf_net [get_bd_intf_pins register_sc/M01_AXI] [get_bd_intf_pins M01_AXI]
connect_bd_intf_net [get_bd_intf_pins pcie_bridge_1/pcie_mgt] [get_bd_intf_pins pcie_mgt_1]
connect_bd_intf_net [get_bd_intf_pins pcie0_refclk] [get_bd_intf_pins clock_buffer_0/CLK_IN_D]
connect_bd_intf_net [get_bd_intf_pins AXI_PCI00] [get_bd_intf_pins smartconnect_0/S00_AXI]
connect_bd_intf_net [get_bd_intf_pins AXI_PCI10] [get_bd_intf_pins smartconnect_1/S00_AXI]
connect_bd_intf_net [get_bd_intf_pins axi4_lite_plug_0/M_AXI] [get_bd_intf_pins pcie_bridge_0/S_AXI_LITE]
connect_bd_intf_net [get_bd_intf_pins axi4_lite_plug_1/M_AXI] [get_bd_intf_pins pcie_bridge_1/S_AXI_LITE]
connect_bd_intf_net [get_bd_intf_pins cmac_config/M_AXI] [get_bd_intf_pins register_sc/S01_AXI]
connect_bd_intf_net [get_bd_intf_pins pcie1_refclk] [get_bd_intf_pins clock_buffer_1/CLK_IN_D]
connect_bd_intf_net [get_bd_intf_pins pcie_bridge_0/M_AXI_B] [get_bd_intf_pins register_sc/S00_AXI]
connect_bd_intf_net [get_bd_intf_pins pcie_mgt_0] [get_bd_intf_pins pcie_bridge_0/pcie_mgt]
connect_bd_intf_net [get_bd_intf_pins axi_revision/S_AXI] [get_bd_intf_pins register_sc/M02_AXI]
connect_bd_intf_net [get_bd_intf_pins CMAC0_STAT] [get_bd_intf_pins register_sc/M03_AXI]
connect_bd_intf_net [get_bd_intf_pins CMAC1_STAT] [get_bd_intf_pins register_sc/M04_AXI]
connect_bd_intf_net [get_bd_intf_pins M05_AXI] [get_bd_intf_pins register_sc/M05_AXI]
connect_bd_intf_net [get_bd_intf_pins M06_AXI] [get_bd_intf_pins register_sc/M06_AXI]
connect_bd_intf_net [get_bd_intf_pins smartconnect_0/M00_AXI] [get_bd_intf_pins pcie_bridge_0/S_AXI_B]
connect_bd_intf_net [get_bd_intf_pins pcie_bridge_1/S_AXI_B] [get_bd_intf_pins smartconnect_1/M00_AXI]
connect_bd_net -net clock_buffer_1_IBUF_DS_ODIV2 [get_bd_pins clock_buffer_0/IBUF_DS_ODIV2] [get_bd_pins pcie_bridge_0/sys_clk]
connect_bd_net [get_bd_pins clock_buffer_1/IBUF_DS_ODIV2] [get_bd_pins pcie_bridge_1/sys_clk]
connect_bd_net -net clock_buffer_1_IBUF_OUT [get_bd_pins clock_buffer_0/IBUF_OUT] [get_bd_pins pcie_bridge_0/sys_clk_gt]
connect_bd_net [get_bd_pins clock_buffer_1/IBUF_OUT] [get_bd_pins pcie_bridge_1/sys_clk_gt]
connect_bd_net [get_bd_pins pcie_bridge_0/axi_aclk] \
  [get_bd_pins axi_aclk] [get_bd_pins axi4_lite_plug_0/clk] [get_bd_pins register_sc/aclk] \
  [get_bd_pins axi_revision/AXI_ACLK] [get_bd_pins smartconnect_0/aclk] [get_bd_pins smartconnect_1/aclk1] \
  [get_bd_pins cmac_config/clk]
connect_bd_net [get_bd_pins pcie_bridge_0/axi_aresetn] \
  [get_bd_pins axi_aresetn] [get_bd_pins register_sc/aresetn] [get_bd_pins axi_revision/AXI_ARESETN] \
  [get_bd_pins smartconnect_0/aresetn] [get_bd_pins cmac_config/resetn]
connect_bd_net [get_bd_pins pcie_bridge_1/axi_aclk] [get_bd_pins axi4_lite_plug_1/clk] [get_bd_pins smartconnect_1/aclk]
connect_bd_net [get_bd_pins pcie_bridge_1/axi_aresetn] [get_bd_pins smartconnect_1/aresetn]
connect_bd_net -net sys_rst_n_0_1 [get_bd_pins pcie_perst_l] [get_bd_pins pcie_bridge_0/sys_rst_n] [get_bd_pins pcie_bridge_1/sys_rst_n]

current_bd_instance /ethernet
connect_bd_intf_net [get_bd_intf_pins s1_axi_stat] [get_bd_intf_pins eth1/s_axi]
connect_bd_intf_net [get_bd_intf_pins axis_pb0] [get_bd_intf_pins eth0/axis_pb]
connect_bd_intf_net [get_bd_intf_pins axis_pb1] [get_bd_intf_pins eth1/axis_pb]
connect_bd_intf_net [get_bd_intf_pins axis_tx0] [get_bd_intf_pins eth0/axis_tx]
connect_bd_intf_net [get_bd_intf_pins axis_tx1] [get_bd_intf_pins eth1/axis_tx]
connect_bd_intf_net [get_bd_intf_pins qsfp0_gt] [get_bd_intf_pins eth0/gt_serial_port]
connect_bd_intf_net [get_bd_intf_pins axis_rx0] [get_bd_intf_pins eth0/M_AXIS]
connect_bd_intf_net [get_bd_intf_pins axis_rx1] [get_bd_intf_pins eth1/M_AXIS]
connect_bd_intf_net [get_bd_intf_pins qsfp1_gt] [get_bd_intf_pins eth1/gt_serial_port]
connect_bd_intf_net [get_bd_intf_pins qsfp0_clk] [get_bd_intf_pins eth0/gt_ref_clk]
connect_bd_intf_net [get_bd_intf_pins qsfp1_clk] [get_bd_intf_pins eth1/gt_ref_clk]
connect_bd_intf_net [get_bd_intf_pins s0_axi_stat] [get_bd_intf_pins eth0/s_axi]
connect_bd_net -net async_source_select_1 [get_bd_pins tx0_mux_sel] [get_bd_pins eth0/async_source_select]
connect_bd_net [get_bd_pins eth0/cmac_clk] [get_bd_pins cmac0_clk]
connect_bd_net [get_bd_pins eth0/rx_aligned] [get_bd_pins status_leds/link0_up]
connect_bd_net [get_bd_pins eth1/cmac_clk] [get_bd_pins cmac1_clk]
connect_bd_net [get_bd_pins eth1/rx_aligned] [get_bd_pins status_leds/link1_up]
connect_bd_net -net source_select1_1 [get_bd_pins tx1_mux_sel] [get_bd_pins eth1/async_source_select]
connect_bd_net [get_bd_pins status_leds/link_status] [get_bd_pins link_status]
connect_bd_net [get_bd_pins status_leds/qsfp0_leds] [get_bd_pins qsfp0_leds]
connect_bd_net [get_bd_pins status_leds/qsfp1_leds] [get_bd_pins qsfp1_leds]
connect_bd_net [get_bd_pins sys_clk] [get_bd_pins eth0/sys_clk] [get_bd_pins eth1/sys_clk]

current_bd_instance /ethernet/eth0
connect_bd_intf_net [get_bd_intf_pins tx_mux/axis_tx] [get_bd_intf_pins axis_tx]
connect_bd_intf_net [get_bd_intf_pins tx_mux/axis_pb] [get_bd_intf_pins axis_pb]
connect_bd_intf_net [get_bd_intf_pins cmac_rx_slice/axis_in] [get_bd_intf_pins cmac_usplus/axis_rx]
connect_bd_intf_net [get_bd_intf_pins cmac_rx_slice/axis_in] [get_bd_intf_pins system_ila/SLOT_0_AXIS]
connect_bd_intf_net [get_bd_intf_pins axi_register_slice/M_AXI] [get_bd_intf_pins cmac_usplus/s_axi]
connect_bd_intf_net [get_bd_intf_pins cmac_control/ctl_tx] [get_bd_intf_pins cmac_usplus/ctl_tx]
connect_bd_intf_net [get_bd_intf_pins cmac_control/gt_trans_debug] [get_bd_intf_pins cmac_usplus/gt_trans_debug]
connect_bd_intf_net [get_bd_intf_pins M_AXIS] [get_bd_intf_pins cmac_rx_slice/axis_out]
connect_bd_intf_net [get_bd_intf_pins tx_mux/axis_out] [get_bd_intf_pins cmac_usplus/axis_tx]
connect_bd_intf_net [get_bd_intf_pins tx_mux/axis_out] [get_bd_intf_pins system_ila/SLOT_1_AXIS]
connect_bd_intf_net [get_bd_intf_pins gt_serial_port] [get_bd_intf_pins cmac_usplus/gt_serial_port]
connect_bd_intf_net [get_bd_intf_pins cmac_control/stat_rx] [get_bd_intf_pins cmac_usplus/stat_rx]
connect_bd_intf_net [get_bd_intf_pins gt_ref_clk] [get_bd_intf_pins cmac_usplus/gt_ref_clk]
connect_bd_intf_net [get_bd_intf_pins s_axi] [get_bd_intf_pins axi_register_slice/S_AXI]
connect_bd_net [get_bd_pins async_source_select] [get_bd_pins tx_mux/async_source_select]
connect_bd_net -net cmac_control_0_reset_rx_datapath [get_bd_pins cmac_control/reset_rx_datapath] [get_bd_pins cmac_usplus/gtwiz_reset_rx_datapath]
connect_bd_net -net cmac_control_0_sys_reset_out [get_bd_pins cmac_control/sys_reset_out] [get_bd_pins cmac_usplus/sys_reset]
connect_bd_net [get_bd_pins cmac_control/sync_rx_aligned] [get_bd_pins rx_aligned]
connect_bd_net -net cmac_usplus_0_gt_txusrclk2 [get_bd_pins cmac_usplus/gt_txusrclk2] \
  [get_bd_pins cmac_usplus/rx_clk] [get_bd_pins cmac_control/rx_clk] [get_bd_pins system_ila/clk] [get_bd_pins cmac_clk] \
  [get_bd_pins cmac_rx_slice/clk] [get_bd_pins tx_mux/cmac_clk]
connect_bd_net [get_bd_pins cmac_usplus/rx_preambleout] [get_bd_pins system_ila/probe0]
connect_bd_net [get_bd_pins one/dout] [get_bd_pins cmac_control/sys_resetn_in] [get_bd_pins tx_mux/resetn] [get_bd_pins axi_register_slice/aresetn]
connect_bd_net [get_bd_pins sys_clk] \
  [get_bd_pins cmac_usplus/init_clk] [get_bd_pins cmac_usplus/drp_clk] [get_bd_pins cmac_usplus/gt_drpclk] \
  [get_bd_pins cmac_control/init_clk] [get_bd_pins cmac_usplus/s_axi_aclk] [get_bd_pins tx_mux/sys_clk] \
  [get_bd_pins axi_register_slice/aclk]

current_bd_instance /ethernet/eth0/tx_mux
connect_bd_intf_net [get_bd_intf_pins axis_tx] [get_bd_intf_pins cmac_tx_cdc/s_axis]
connect_bd_intf_net [get_bd_intf_pins axis_pb] [get_bd_intf_pins axis_mux/axis_in1]
connect_bd_intf_net [get_bd_intf_pins axis_out] [get_bd_intf_pins axis_mux/axis_out]
connect_bd_intf_net [get_bd_intf_pins cmac_tx_cdc/m_axis] [get_bd_intf_pins axis_mux/axis_in0]
connect_bd_net [get_bd_pins async_source_select] [get_bd_pins axis_mux/async_source_select]
connect_bd_net -net cmac_usplus_0_gt_txusrclk2 [get_bd_pins cmac_clk] [get_bd_pins axis_mux/clk] [get_bd_pins cmac_tx_cdc/cmac_clk]
connect_bd_net -net one_dout [get_bd_pins resetn] [get_bd_pins cmac_tx_cdc/resetn]
connect_bd_net [get_bd_pins sys_clk] [get_bd_pins cmac_tx_cdc/sys_clk]

current_bd_instance /ethernet/eth1
connect_bd_intf_net [get_bd_intf_pins M_AXIS] [get_bd_intf_pins cmac_rx_slice/axis_out]
connect_bd_intf_net [get_bd_intf_pins axi_register_slice/M_AXI] [get_bd_intf_pins cmac_usplus/s_axi]
connect_bd_intf_net [get_bd_intf_pins axis_pb] [get_bd_intf_pins tx_mux/axis_pb]
connect_bd_intf_net [get_bd_intf_pins axis_tx] [get_bd_intf_pins tx_mux/axis_tx]
connect_bd_intf_net [get_bd_intf_pins cmac_control/ctl_tx] [get_bd_intf_pins cmac_usplus/ctl_tx]
connect_bd_intf_net [get_bd_intf_pins cmac_control/gt_trans_debug] [get_bd_intf_pins cmac_usplus/gt_trans_debug]
connect_bd_intf_net [get_bd_intf_pins gt_serial_port] [get_bd_intf_pins cmac_usplus/gt_serial_port]
connect_bd_intf_net [get_bd_intf_pins cmac_control/stat_rx] [get_bd_intf_pins cmac_usplus/stat_rx]
connect_bd_intf_net [get_bd_intf_pins cmac_rx_slice/axis_in] [get_bd_intf_pins cmac_usplus/axis_rx]
connect_bd_intf_net [get_bd_intf_pins cmac_rx_slice/axis_in] [get_bd_intf_pins system_ila/SLOT_0_AXIS]
connect_bd_intf_net [get_bd_intf_pins gt_ref_clk] [get_bd_intf_pins cmac_usplus/gt_ref_clk]
connect_bd_intf_net [get_bd_intf_pins s_axi] [get_bd_intf_pins axi_register_slice/S_AXI]
connect_bd_intf_net [get_bd_intf_pins tx_mux/axis_out] [get_bd_intf_pins cmac_usplus/axis_tx]
connect_bd_net [get_bd_pins async_source_select] [get_bd_pins tx_mux/async_source_select]
connect_bd_net -net cmac_control_0_reset_rx_datapath [get_bd_pins cmac_control/reset_rx_datapath] [get_bd_pins cmac_usplus/gtwiz_reset_rx_datapath]
connect_bd_net -net cmac_control_0_sys_reset_out [get_bd_pins cmac_control/sys_reset_out] [get_bd_pins cmac_usplus/sys_reset]
connect_bd_net [get_bd_pins cmac_control/sync_rx_aligned] [get_bd_pins rx_aligned]
connect_bd_net -net cmac_usplus_0_gt_txusrclk2 [get_bd_pins cmac_usplus/gt_txusrclk2] \
  [get_bd_pins cmac_usplus/rx_clk] [get_bd_pins cmac_control/rx_clk] [get_bd_pins system_ila/clk] [get_bd_pins cmac_clk] \
  [get_bd_pins cmac_rx_slice/clk] [get_bd_pins tx_mux/cmac_clk]
connect_bd_net [get_bd_pins cmac_usplus/rx_preambleout] [get_bd_pins system_ila/probe0]
connect_bd_net [get_bd_pins one/dout] [get_bd_pins cmac_control/sys_resetn_in] [get_bd_pins axi_register_slice/aresetn] [get_bd_pins tx_mux/resetn]
connect_bd_net [get_bd_pins sys_clk] \
  [get_bd_pins cmac_usplus/init_clk] [get_bd_pins cmac_usplus/drp_clk] [get_bd_pins cmac_usplus/gt_drpclk] \
  [get_bd_pins cmac_control/init_clk] [get_bd_pins cmac_usplus/s_axi_aclk] [get_bd_pins axi_register_slice/aclk] \
  [get_bd_pins tx_mux/sys_clk]

current_bd_instance /ethernet/eth1/tx_mux
connect_bd_intf_net [get_bd_intf_pins axis_tx] [get_bd_intf_pins cmac_tx_cdc/s_axis]
connect_bd_intf_net [get_bd_intf_pins axis_pb] [get_bd_intf_pins axis_mux/axis_in1]
connect_bd_intf_net [get_bd_intf_pins axis_out] [get_bd_intf_pins axis_mux/axis_out]
connect_bd_intf_net [get_bd_intf_pins cmac_tx_cdc/m_axis] [get_bd_intf_pins axis_mux/axis_in0]
connect_bd_net [get_bd_pins async_source_select] [get_bd_pins axis_mux/async_source_select]
connect_bd_net -net cmac_usplus_0_gt_txusrclk2 [get_bd_pins cmac_clk] [get_bd_pins axis_mux/clk] [get_bd_pins cmac_tx_cdc/cmac_clk]
connect_bd_net -net one_dout [get_bd_pins resetn] [get_bd_pins cmac_tx_cdc/resetn]
connect_bd_net [get_bd_pins sys_clk] [get_bd_pins cmac_tx_cdc/sys_clk]

current_bd_instance /channel_0
connect_bd_intf_net [get_bd_intf_pins S_AXI_CTL] [get_bd_intf_pins control/S_AXI]
connect_bd_intf_net [get_bd_intf_pins S_AXI_PB] [get_bd_intf_pins playback/S_AXI_PB]
connect_bd_intf_net [get_bd_intf_pins axis_in] [get_bd_intf_pins datapath/axis_in]
connect_bd_intf_net [get_bd_intf_pins PCI_AXI] [get_bd_intf_pins datapath/PCI_AXI]
connect_bd_intf_net [get_bd_intf_pins hbm_refclk] [get_bd_intf_pins datapath/hbm_refclk]
connect_bd_intf_net [get_bd_intf_pins axis_pg_out] [get_bd_intf_pins packet_gen/axis_out]
connect_bd_intf_net [get_bd_intf_pins M_AXI_PB] [get_bd_intf_pins playback/M_AXI_PCI]
connect_bd_intf_net [get_bd_intf_pins axis_pb_out] [get_bd_intf_pins playback/axis_out]
connect_bd_net [get_bd_pins async_link_status] [get_bd_pins control/async_link_status]
connect_bd_net [get_bd_pins cmac_clk] [get_bd_pins datapath/cmac_clk] [get_bd_pins playback/cmac_clk]
connect_bd_net [get_bd_pins control/copy_blocks] [get_bd_pins datapath/block_count]
connect_bd_net [get_bd_pins control/copy_to_host_stb] [get_bd_pins datapath/start_copy_stb]
connect_bd_net [get_bd_pins control/enable] [get_bd_pins datapath/enable]
connect_bd_net [get_bd_pins control/host_addr] [get_bd_pins datapath/host_addr]
connect_bd_net [get_bd_pins control/resetn_out] [get_bd_pins datapath/sys_resetn]
connect_bd_net [get_bd_pins control/send_count] [get_bd_pins packet_gen/packet_count]
connect_bd_net [get_bd_pins control/send_size] [get_bd_pins packet_gen/packet_length]
connect_bd_net [get_bd_pins control/send_stb] [get_bd_pins packet_gen/start_stb]
connect_bd_net [get_bd_pins datapath/blocks_captured] [get_bd_pins control/async_block_count]
connect_bd_net [get_bd_pins datapath/copy_idle] [get_bd_pins control/copy_complete]
connect_bd_net [get_bd_pins datapath/done] [get_bd_pins control/async_capture_complete]
connect_bd_net [get_bd_pins datapath/hbm_cattrip] [get_bd_pins hbm_cattrip]
connect_bd_net [get_bd_pins datapath/hbm_temp] [get_bd_pins control/async_hbm_temp]
connect_bd_net [get_bd_pins datapath/packets_captured] [get_bd_pins control/async_packet_count]
connect_bd_net -net packet_gen_0_busy [get_bd_pins packet_gen/busy] [get_bd_pins control/send_busy]
connect_bd_net -net pcie_axi_aresetn [get_bd_pins resetn] \
  [get_bd_pins control/resetn] [get_bd_pins packet_gen/resetn] [get_bd_pins playback/sys_resetn]
connect_bd_net [get_bd_pins playback/pb_mux_sel] [get_bd_pins pb_mux_sel]
connect_bd_net [get_bd_pins sys_clk] \
  [get_bd_pins control/clk] [get_bd_pins datapath/sys_clk] [get_bd_pins packet_gen/clk] [get_bd_pins playback/sys_clk]
